# EAGLE design Bee Snuggler - Main (EAGLE 9.6.2)
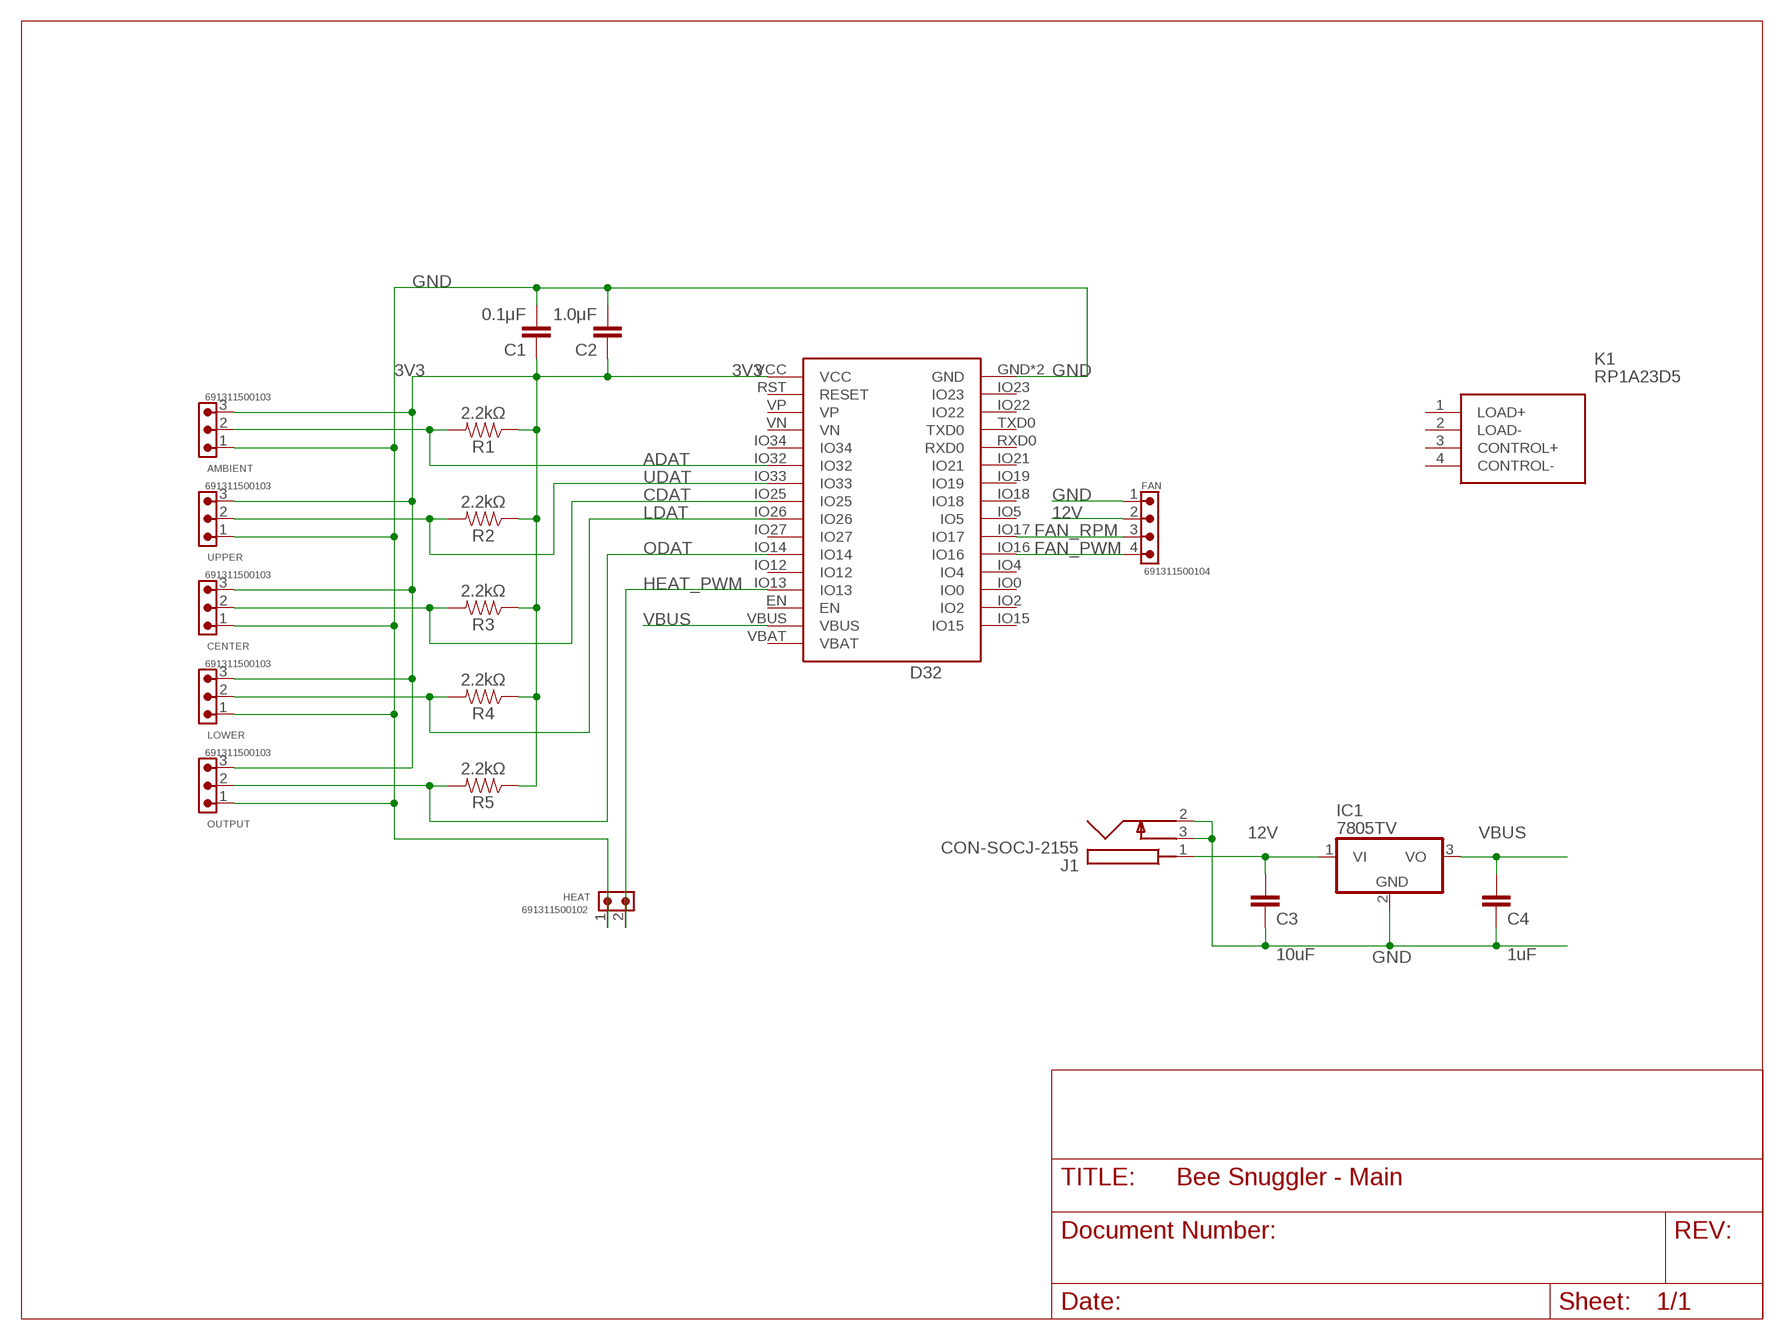
[diagram p0: schematic, sheet 1]

## Parts
AMBIENT  691311500103  691311500103  [691311500103]
C1  0.1μF  CAP_CERAMIC_2.54  [CAP_PTH-2.54]
C2  1.0μF  CAP_CERAMIC_2.54  [CAP_PTH-2.54]
C3  10uF  CAP_CERAMIC_2.54  [CAP_PTH-2.54]
C4  1uF  CAP_CERAMIC_2.54  [CAP_PTH-2.54]
CENTER  691311500103  691311500103  [691311500103]
D32  Lolin D32  WEMOS-D32D32_PRO  [D32_PRO]
FAN  691311500104  691311500104  [691311500104]
HEAT  691311500102  691311500102  [691311500102]
IC1  7805TV  [TO220V]
J1  CON-SOCJ-2155  [CONSOCJ2155]
K1  RP1A23D5  [RP1A23D5]
LOWER  691311500103  691311500103  [691311500103]
OUTPUT  691311500103  691311500103  [691311500103]
R1  2.2kΩ  RESISTORAXIAL-0.3  [AXIAL-0.3]
R2  2.2kΩ  RESISTORAXIAL-0.3  [AXIAL-0.3]
R3  2.2kΩ  RESISTORAXIAL-0.3  [AXIAL-0.3]
R4  2.2kΩ  RESISTORAXIAL-0.3  [AXIAL-0.3]
R5  2.2kΩ  RESISTORAXIAL-0.3  [AXIAL-0.3]
UPPER  691311500103  691311500103  [691311500103]

## Nets
3V3 [3v]: AMBIENT.3 C1.1 C2.1 CENTER.3 D32.VCC LOWER.3 OUTPUT.3 R1.P$1 R2.P$1 R3.P$1 R4.P$1 R5.P$1 UPPER.3
12V: C3.1 FAN.2 IC1.1(VI) J1.1
ADAT: AMBIENT.2 D32.IO32 R1.P$2
CDAT: CENTER.2 D32.IO25 R3.P$2
FAN_PWM: D32.IO16 FAN.4
FAN_RPM: D32.IO17 FAN.3
GND: AMBIENT.1 C1.2 C2.2 C3.2 C4.2 CENTER.1 D32.GND D32.GND2(GND) FAN.1 HEAT.1 IC1.2(GND) J1.2 J1.3 LOWER.1 OUTPUT.1 UPPER.1
HEAT_PWM: D32.IO13 HEAT.2
LDAT: D32.IO26 LOWER.2 R4.P$2
ODAT: D32.IO14 OUTPUT.2 R5.P$2
UDAT: D32.IO33 R2.P$2 UPPER.2
VBUS: C4.1 D32.VBUS IC1.3(VO)
Unconnected: D32.EN D32.IO0 D32.IO2 D32.IO4 D32.IO5 D32.IO12 D32.IO15 D32.IO18 D32.IO19 D32.IO21 D32.IO22 D32.IO23 D32.IO27 D32.IO34 D32.RST(RESET) D32.RXD0 D32.TXD0 D32.VBAT D32.VN D32.VP K1.1(LOAD+) K1.2(LOAD-) K1.3(CONTROL+) K1.4(CONTROL-)

## Library data of the parts
AMBIENT CENTER LOWER OUTPUT UPPER = Wurth_Connectors_WR-TBL Pluggable Connector:691311500103: WR-TBL Serie 311 - 5.08 mm Close Vertical PCB Header KIND PROPERTIES Pitch 5.08 mm MATERIAL PROPERTIES Insulator Material PA66 Insulator Flammability Rating UL94 V-0 Insulator Color Green Contact Material Brass Contact Plating Tin GENERAL INFORMATION Operating Temperature -40 up to +105 °C ELECTRICAL PROPERTIES IR cULus 20 A IR VDE 20 A Working Voltage [cULus] 300 V (AC) Working Voltage [VDE] 300 V (AC) Withstanding Voltage [cULus] 1600 V (AC) Withstanding Voltage [VDE] 2500 V (AC) Contact Resistance [cULus] 20 mΩ Contact Resistance [VDE] 20 mΩ CERTIFICATION cULus Approval E315414 VDE Approval 40023195 <https://www.we-online.com/catalog/media/o33258v209%20Family_WR-TBL_6913115001xx.jpg> Details see: https://www.we-online.com/catalog/en/TBL_5_08_311_CLOSE_VERTICAL_PCB_HEADER_6913115001XX/ Updated by Ella Wu 2019-12-24 2019(C) Wurth Elektronik; DATASHEET-URL: https://www.we-online.com/catalog/datasheet/691311500103.pdf; IR-UL: 20A; IR-VDE: 20A; MOUNT: THT; PART-NUMBER: 691311500103; PINS: 3; PITCH: 5.08mm; TYPE: Vertical; WORKING-VOLTAGE-UL: 300V (AC); WORKING-VOLTAGE-VDE: 300V (AC)
C1-C4 = Donnie:CAP_CERAMIC_2.54
D32 = Donnie:WEMOS-D32: D32_REVERSE is a Reverse silkscreen for placing the Wemos D32 on the underside of the board D32_NO-KEEPOUT removes the keepout area beneath the antenna on the D32 and provides a note to avoid components and traces.
FAN = Wurth_Connectors_WR-TBL Pluggable Connector:691311500104: WR-TBL Serie 311 - 5.08 mm Close Vertical PCB Header KIND PROPERTIES Pitch 5.08 mm MATERIAL PROPERTIES Insulator Material PA66 Insulator Flammability Rating UL94 V-0 Insulator Color Green Contact Material Brass Contact Plating Tin GENERAL INFORMATION Operating Temperature -40 up to +105 °C ELECTRICAL PROPERTIES IR cULus 20 A IR VDE 20 A Working Voltage [cULus] 300 V (AC) Working Voltage [VDE] 300 V (AC) Withstanding Voltage [cULus] 1600 V (AC) Withstanding Voltage [VDE] 2500 V (AC) Contact Resistance [cULus] 20 mΩ Contact Resistance [VDE] 20 mΩ CERTIFICATION cULus Approval E315414 VDE Approval 40023195 <https://www.we-online.com/catalog/media/o33258v209%20Family_WR-TBL_6913115001xx.jpg> Details see: https://www.we-online.com/catalog/en/TBL_5_08_311_CLOSE_VERTICAL_PCB_HEADER_6913115001XX/ Updated by Ella Wu 2019-12-24 2019(C) Wurth Elektronik; DATASHEET-URL: https://www.we-online.com/catalog/datasheet/691311500104.pdf; IR-UL: 20A; IR-VDE: 20A; MOUNT: THT; PART-NUMBER: 691311500104; PINS: 4; PITCH: 5.08mm; TYPE: Vertical; WORKING-VOLTAGE-UL: 300V (AC); WORKING-VOLTAGE-VDE: 300V (AC)
HEAT = Wurth_Connectors_WR-TBL Pluggable Connector:691311500102: WR-TBL Serie 311 - 5.08 mm Close Vertical PCB Header KIND PROPERTIES Pitch 5.08 mm MATERIAL PROPERTIES Insulator Material PA66 Insulator Flammability Rating UL94 V-0 Insulator Color Green Contact Material Brass Contact Plating Tin GENERAL INFORMATION Operating Temperature -40 up to +105 °C ELECTRICAL PROPERTIES IR cULus 20 A IR VDE 20 A Working Voltage [cULus] 300 V (AC) Working Voltage [VDE] 300 V (AC) Withstanding Voltage [cULus] 1600 V (AC) Withstanding Voltage [VDE] 2500 V (AC) Contact Resistance [cULus] 20 mΩ Contact Resistance [VDE] 20 mΩ CERTIFICATION cULus Approval E315414 VDE Approval 40023195 <https://www.we-online.com/catalog/media/o33258v209%20Family_WR-TBL_6913115001xx.jpg> Details see: https://www.we-online.com/catalog/en/TBL_5_08_311_CLOSE_VERTICAL_PCB_HEADER_6913115001XX/ Updated by Ella Wu 2019-12-24 2019(C) Wurth Elektronik; DATASHEET-URL: https://www.we-online.com/catalog/datasheet/691311500102.pdf; IR-UL: 20A; IR-VDE: 20A; MOUNT: THT; PART-NUMBER: 691311500102; PINS: 2; PITCH: 5.08mm; TYPE: Vertical; WORKING-VOLTAGE-UL: 300V (AC); WORKING-VOLTAGE-VDE: 300V (AC)
IC1 = linear:78*: Positive VOLTAGE REGULATOR Source: http://cache.national.com/ds/LM/LM78L05.pdf http://www.fairchildsemi.com/ds/LM/LM7805.pdf
J1 = SamacSys_Parts:CON-SOCJ-2155: DC Power Connectors Power Jack/Connector 2.1mm x 5.5mm Source: Datasheet <http://www.produktinfo.conrad.com/datenblaetter/1500000-1599999/001582350-da-01-en-DC_EINBAUBUCHSE__SCHALTER_GESCHLOSSEN.pdf>; DESCRIPTION: DC Power Connectors Power Jack/Connector 2.1mm x 5.5mm; HEIGHT: 11mm; MANUFACTURER_NAME: Gravitech; MANUFACTURER_PART_NUMBER: CON-SOCJ-2155; MOUSER_PART_NUMBER: 992-CON-SOCJ-2155; MOUSER_PRICE-STOCK: https://www.mouser.co.uk/ProductDetail/Gravitech/CON-SOCJ-2155?qs=fkzBJ5HM%252BdCcpvFQyQZHtA%3D%3D
K1 = SamacSys_Parts:RP1A23D5: Solid State Relay PC Pin 5 A PCB Mount, Zero Crossing, 32 V dc Source: Datasheet <https://www.gavazzionline.com/pdf/rp1a48d5.pdf>; DESCRIPTION: Solid State Relay PC Pin 5 A PCB Mount, Zero Crossing, 32 V dc; HEIGHT: mm; MANUFACTURER_NAME: Carlo Gavazzi; MANUFACTURER_PART_NUMBER: RP1A23D5; MOUSER_PART_NUMBER: 225-RP1A23D5; MOUSER_PRICE-STOCK: https://www.mouser.co.uk/ProductDetail/Carlo-Gavazzi/RP1A23D5?qs=xZ%2FP%252Ba9zWqYrTlescD3zNw%3D%3D
R1-R5 = SparkFun-Resistors:RESISTOR: Generic Resistor Package

## Net classes
0 default: width 0.305 mm, clearance 0.305 mm
1 5v: width 0.406 mm, clearance 0.406 mm
2 3v: width 0.406 mm, clearance 0.406 mm

## Board
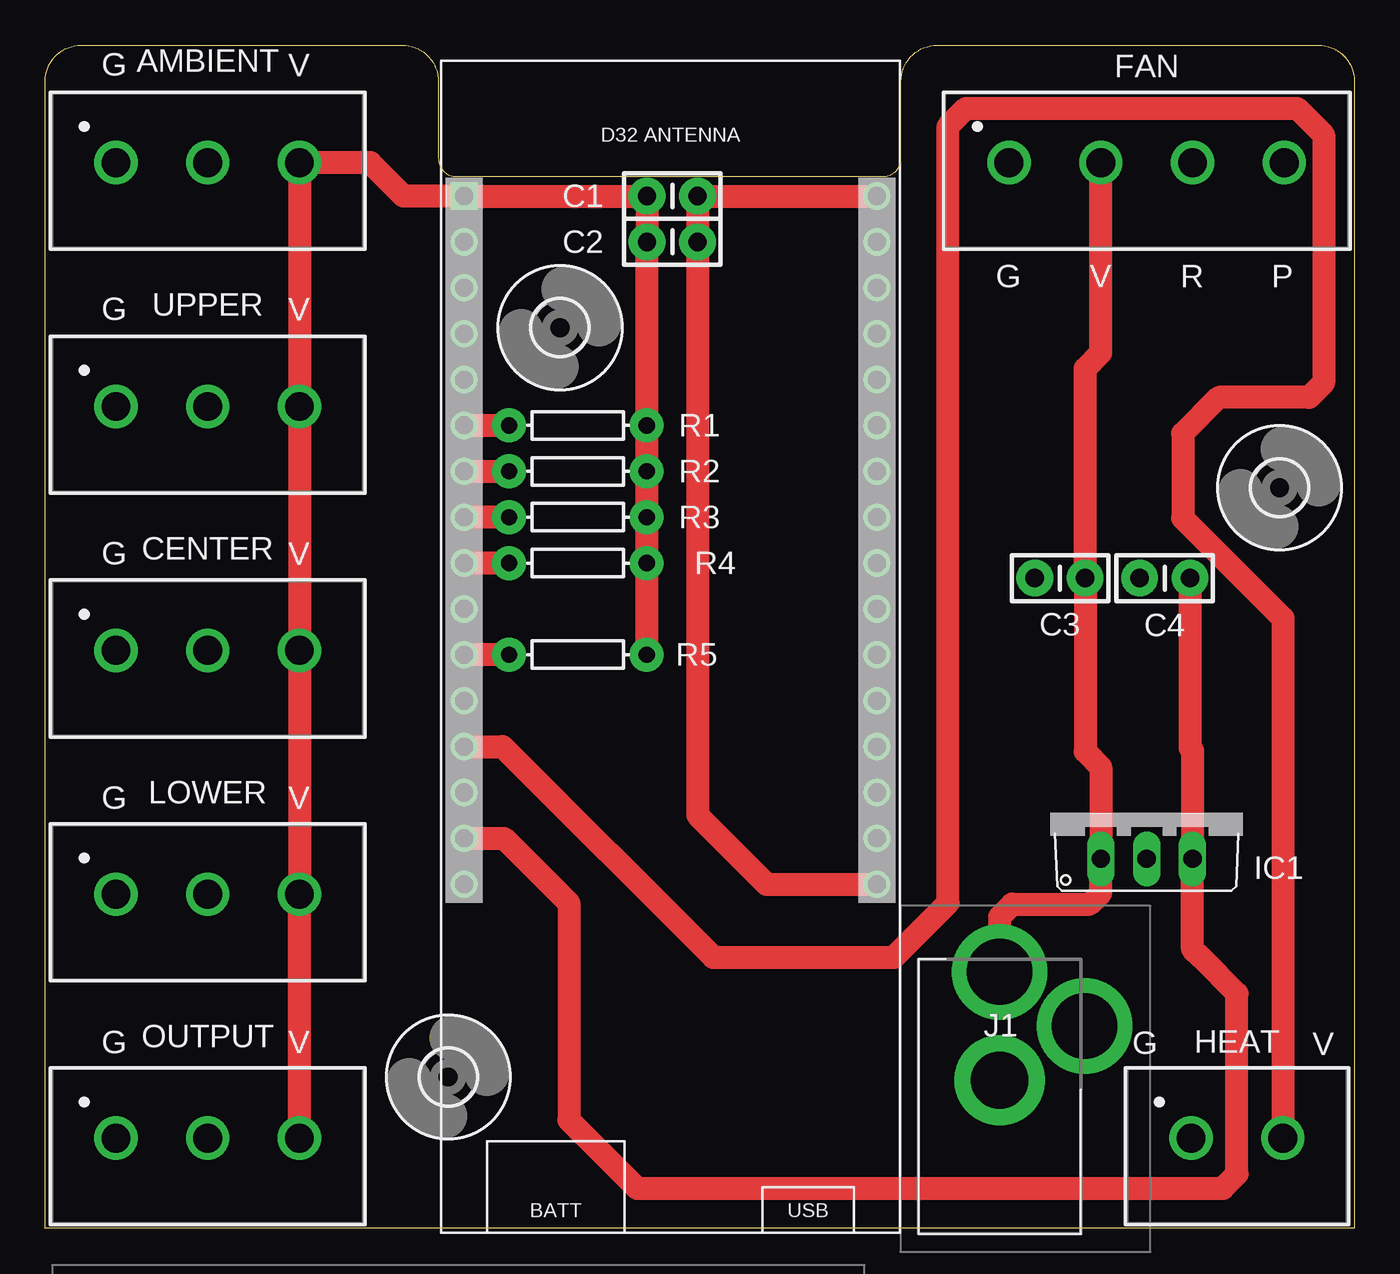
[diagram p1: board, top side]
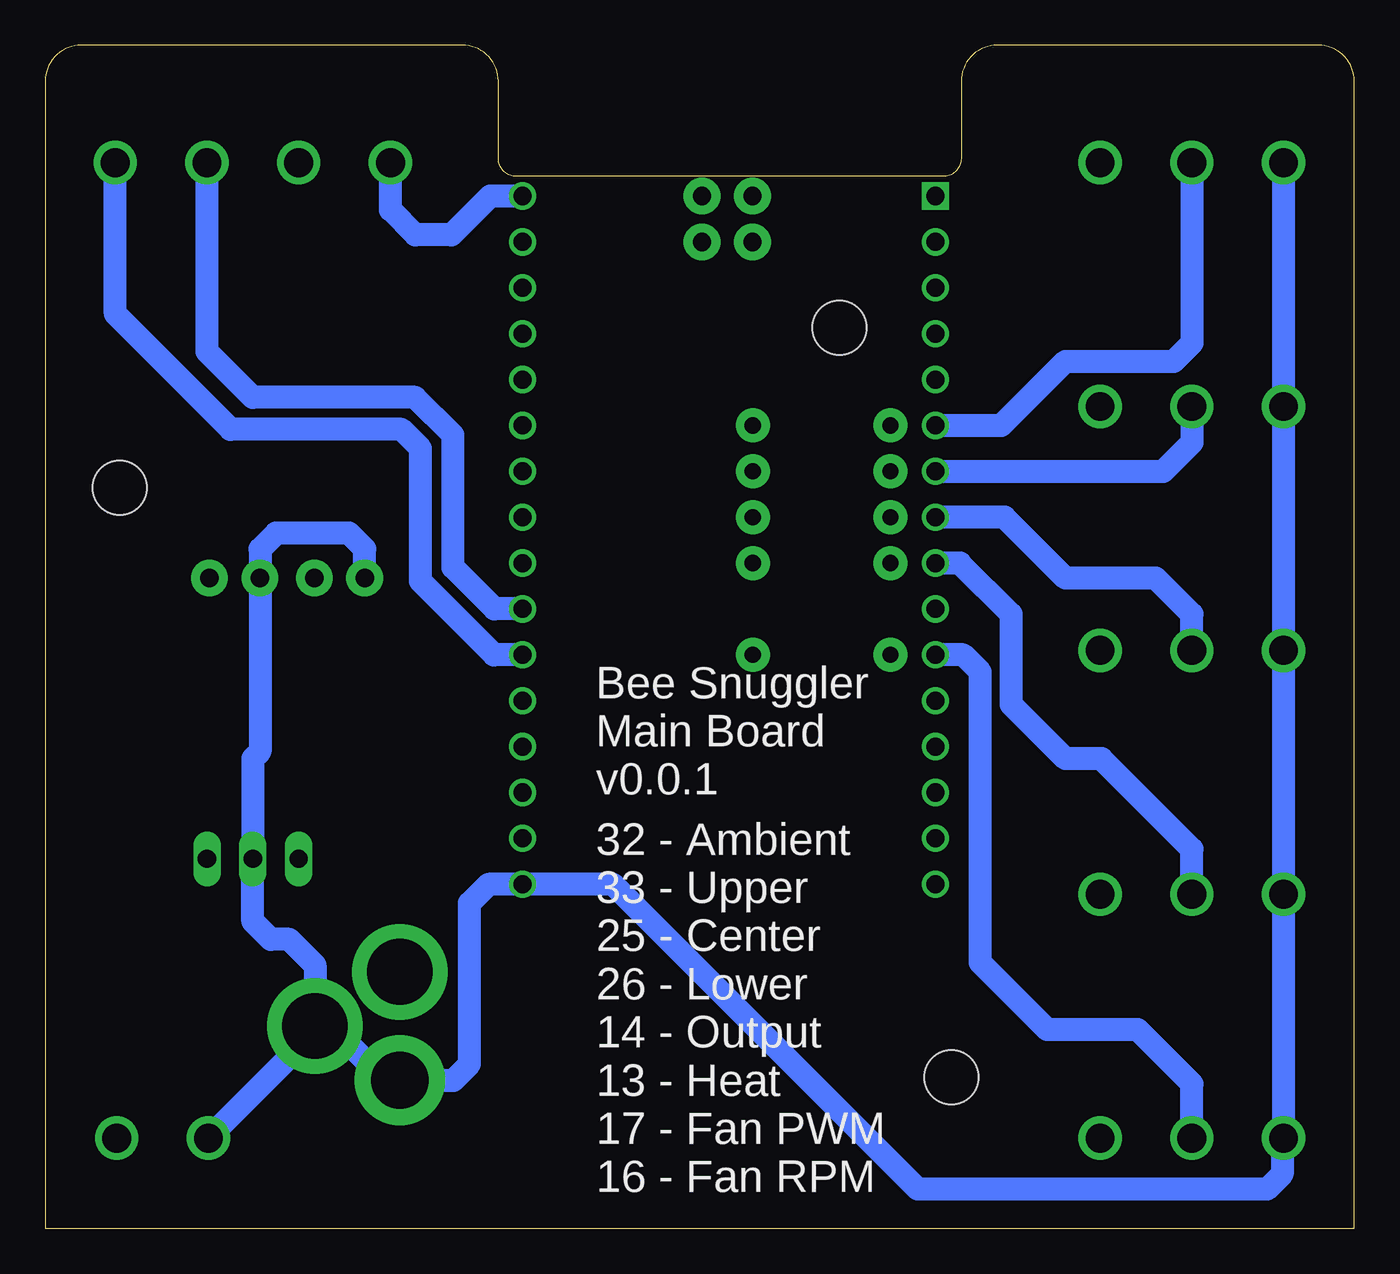
[diagram p2: board, bottom side, seen from below]

Size 72.5 x 65.5 mm. Coordinates in mm from the lower left corner, seen from the top.
Outline: 72.5,0 0,0 0,63.5 arc-90 2,65.5 19.77,65.5 arc-90 21.77,63.5 21.77,59.23 arc90 22.77,58.23 46.4,58.23 arc90 47.4,59.23 47.4,63.5 arc-90 49.4,65.5 70.5,65.5 arc-90 72.5,63.5 72.5,0
Copper layers (1*16): Top 0.035mm / dielectric 1.5mm / Bottom 0.035mm
Design rules "default": minimum track width 6mil, minimum drill 0.35mm, track to track 6mil, track to pad 6mil, pad to pad 6mil, via to via 6mil, smd to smd 6mil, copper to edge 40mil, drill to drill 6mil, minimum pad ring 10mil, minimum via ring 8mil, stop-mask expansion 4mil, vias tented up to drill 0mil, thermal gap 10mil

### Footprints (pad centres in the part's own frame; a part is rotated, then mirrored left to right if it is on the bottom)
691311500103 = drill 1.6: 1 -5.08,0; 2 0,0; 3 5.08,0
CAP_PTH-2.54 = drill 1.016 pad 2.032: 1 -1.397,0; 2 1.397,0
D32_PRO = drill 1: EN -11.43,-12.7; GND 11.43,20.32; GND2 11.43,-17.78; IO0 11.43,-10.16; IO2 11.43,-12.7; IO4 11.43,-7.62; IO5 11.43,0; IO12 -11.43,-7.62; IO13 -11.43,-10.16; IO14 -11.43,-5.08; IO15 11.43,-15.24; IO16 11.43,-5.08; IO17 11.43,-2.54; IO18 11.43,2.54; IO19 11.43,5.08; IO21 11.43,7.62; IO22 11.43,15.24; IO23 11.43,17.78; IO25 -11.43,2.54; IO26 -11.43,0; IO27 -11.43,-2.54; IO32 -11.43,7.62; IO33 -11.43,5.08; IO34 -11.43,10.16; RST -11.43,17.78; RXD0 11.43,10.16; TXD0 11.43,12.7; VBAT -11.43,-17.78; VBUS -11.43,-15.24; VN -11.43,12.7; VP -11.43,15.24 | drill 1 square: VCC -11.43,20.32
691311500104 = drill 1.6: 1 -7.62,0; 2 -2.54,0; 3 2.54,0; 4 7.62,0
691311500102 = drill 1.6: 1 -2.54,0; 2 2.54,0
TO220V = drill 1.016 long: 1 -2.54,-2.54; 2 0,-2.54; 3 2.54,-2.54
CONSOCJ2155 = drill 3.64 pad 5.3: 1 0,0; 3 -3,-4.7 | drill 3.162 pad 5: 2 -6,0
RP1A23D5 = drill 1.2 pad 1.8: 1 0,0; 2 10.16,0; 3 22.86,0; 4 27.94,0
AXIAL-0.3 = drill 0.9 pad 1.88: P$1 -3.81,0; P$2 3.81,0
3,0 = hole 3: 0,0

### Placement (x,y rotation side)
AMBIENT  9,59 0 top
C1  34.73,57.15 0 top
C2  34.73,54.61 0 top
C3  56.2,36 180 top
C4  62,36 180 top
CENTER  9,32 0 top
D32  34.63,36.83 0 top
FAN  61,59 0 top
HEAT  66,5 0 top
IC1  61,23 0 top
J1  52.86,14.2 90 top
K1  9,-11 0 top  (outside the outline)
LOWER  9,18.5 0 top
OUTPUT  9,5 0 top
R1  29.5,44.45 180 top
R2  29.5,41.91 180 top
R3  29.5,39.37 180 top
R4  29.5,36.83 180 top
R5  29.5,31.76 180 top
U$1  [3,0]  68.36,41 0 top
U$2  [3,0]  22.32,8.38 0 top
U$3  [3,0]  28.51,49.86 0 top
UPPER  9,45.5 0 top

### Tracks (layer width: path | path; a pad name or v marks a point on that pad's centre or on a via)
3V3
  Top 1.27: R5.P$1 R4.P$1 R3.P$1 R2.P$1 R1.P$1 33.31,54.59 C2.1 C1.1 D32.VCC 19.85,57.15 18,59 AMBIENT.3 UPPER.3 CENTER.3 LOWER.3 OUTPUT.3
12V
  Top 1.27: FAN.2 58.46,48.46 57.6,47.6 C3.1 57.6,26.4 58.46,25.54 IC1.1 58.46,18.56 57.85,17.95 53.56,17.95 52.86,17.25 J1.1
ADAT
  Top 1.27: D32.IO32 R1.P$2
  Bottom 1.27: AMBIENT.2 9,49 10,48 16,48 19.55,44.45 D32.IO32
CDAT
  Top 1.27: R3.P$2 D32.IO25
  Bottom 1.27: D32.IO25 19.37,39.37 16,36 11,36 9,34 CENTER.2
FAN_PWM
  Bottom 1.27: D32.IO16 47.64,31.75 51.72,35.83 51.72,43.18 52.77,44.23 62.23,44.23 68.62,50.62 FAN.4
FAN_RPM
  Bottom 1.27: D32.IO17 47.62,34.29 49.92,36.59 49.92,43.92 52,46 61,46 63.54,48.54 FAN.3
GND
  Top 1.27: D32.GND C1.2 C2.2 36.13,22.87 39.95,19.05 D32.GND2
  Bottom 1.27: AMBIENT.1 UPPER.1 CENTER.1 LOWER.1 OUTPUT.1 4,4.92 4,3 4.83,2.17 24.17,2.17 41.05,19.05 D32.GND2 47.95,19.05 49,18 49,9.09 49.89,8.2 J1.2 53.67,8.2 56.67,11.2 J1.3 | C3.2 54.8,37.61 55.68,38.49 59.72,38.49 60.6,37.61 C4.2 60.6,26.4 61,26 IC1.2 61,17 60,16 58.98,16 57.56,14.58 J1.3 | J1.3 58.46,10.3 58.46,10 HEAT.1 | D32.GND 47.85,57.15 50,55 52,55 53.38,56.38 FAN.1
HEAT_PWM
  Top 1.27: D32.IO13 25.33,26.67 37,15 47,15 50,18 50,61 51,62 69.33,62 70.8,60.53 70.8,46.8 70,46 65,46 63,44 63,39.32 68.54,33.78 HEAT.2
LDAT
  Top 1.27: R4.P$2 D32.IO26
  Bottom 1.27: LOWER.2 9,21 14,26 16,26 19,29 19,34 21.83,36.83 D32.IO26
ODAT
  Top 1.27: R5.P$2 D32.IO14
  Bottom 1.27: OUTPUT.2 9,8 12,11 17,11 20.71,14.71 20.71,27 20.71,30.8 21.66,31.75 D32.IO14
UDAT
  Top 1.27: D32.IO33 R2.P$2
  Bottom 1.27: D32.IO33 10.59,41.91 9,43.5 UPPER.2
VBUS
  Top 1.27: D32.VBUS 25.41,21.59 29,18 29,6 32.78,2.22 65.22,2.22 66,3 66,13 64,15 | C4.1 63.4,26.6 63.54,26.46 IC1.3 63.54,15.46 | 64,15 63.54,15.46 | 64,15 63.54,15.46

### Text on the board
tNames: G | V | G | V | R | P | G | V | G | V | G | V | G | V | G | V
bNames: Bee Snuggler / Main Board / v0.0.1 | 32 - Ambient / 33 - Upper / 25 - Center / 26 - Lower / 14 - Output / 13 - Heat / 17 - Fan PWM / 16 - Fan RPM